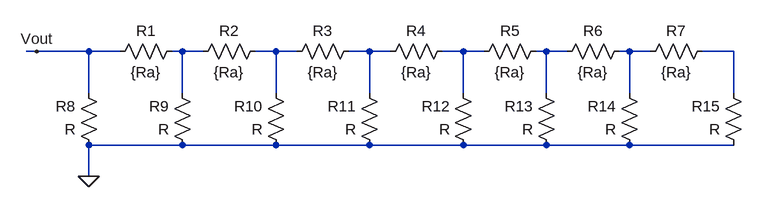
[diagram p0: schematic Draft1.asc]
Draft1.asc, the LTspice schematic file:
Version 4.1
SHEET 1 1108 680
WIRE 16 -80 0 -80
WIRE 96 -80 16 -80
WIRE 144 -80 96 -80
WIRE 240 -80 224 -80
WIRE 272 -80 240 -80
WIRE 384 -80 352 -80
WIRE 416 -80 384 -80
WIRE 528 -80 496 -80
WIRE 560 -80 528 -80
WIRE 672 -80 640 -80
WIRE 704 -80 672 -80
WIRE 800 -80 784 -80
WIRE 832 -80 800 -80
WIRE 928 -80 912 -80
WIRE 960 -80 928 -80
WIRE 1088 -80 1040 -80
WIRE 96 -16 96 -80
WIRE 240 -16 240 -80
WIRE 384 -16 384 -80
WIRE 528 -16 528 -80
WIRE 672 -16 672 -80
WIRE 800 -16 800 -80
WIRE 928 -16 928 -80
WIRE 1088 -16 1088 -80
WIRE 240 64 96 64
WIRE 384 64 240 64
WIRE 528 64 384 64
WIRE 672 64 528 64
WIRE 800 64 672 64
WIRE 928 64 800 64
WIRE 1088 64 928 64
WIRE 96 112 96 64
FLAG 96 112 0
FLAG 16 -80 Vout
SYMBOL res 240 -96 R90
WINDOW 0 0 56 VBottom 2
WINDOW 3 32 56 VTop 2
SYMATTR InstName R1
SYMATTR Value {Ra}
SYMBOL res 368 -96 R90
WINDOW 0 0 56 VBottom 2
WINDOW 3 32 56 VTop 2
SYMATTR InstName R2
SYMATTR Value {Ra}
SYMBOL res 512 -96 R90
WINDOW 0 0 56 VBottom 2
WINDOW 3 32 56 VTop 2
SYMATTR InstName R3
SYMATTR Value {Ra}
SYMBOL res 656 -96 R90
WINDOW 0 0 56 VBottom 2
WINDOW 3 32 56 VTop 2
SYMATTR InstName R4
SYMATTR Value {Ra}
SYMBOL res 800 -96 R90
WINDOW 0 0 56 VBottom 2
WINDOW 3 32 56 VTop 2
SYMATTR InstName R5
SYMATTR Value {Ra}
SYMBOL res 928 -96 R90
WINDOW 0 0 56 VBottom 2
WINDOW 3 32 56 VTop 2
SYMATTR InstName R6
SYMATTR Value {Ra}
SYMBOL res 1056 -96 R90
WINDOW 0 0 56 VBottom 2
WINDOW 3 32 56 VTop 2
SYMATTR InstName R7
SYMATTR Value {Ra}
SYMBOL res 112 80 R180
WINDOW 0 36 76 Left 2
WINDOW 3 36 40 Left 2
SYMATTR InstName R8
SYMBOL res 256 80 R180
WINDOW 0 36 76 Left 2
WINDOW 3 36 40 Left 2
SYMATTR InstName R9
SYMBOL res 400 80 R180
WINDOW 0 36 76 Left 2
WINDOW 3 36 40 Left 2
SYMATTR InstName R10
SYMBOL res 544 80 R180
WINDOW 0 36 76 Left 2
WINDOW 3 36 40 Left 2
SYMATTR InstName R11
SYMBOL res 688 80 R180
WINDOW 0 36 76 Left 2
WINDOW 3 36 40 Left 2
SYMATTR InstName R12
SYMBOL res 816 80 R180
WINDOW 0 36 76 Left 2
WINDOW 3 36 40 Left 2
SYMATTR InstName R13
SYMBOL res 944 80 R180
WINDOW 0 36 76 Left 2
WINDOW 3 36 40 Left 2
SYMATTR InstName R14
SYMBOL res 1104 80 R180
WINDOW 0 36 76 Left 2
WINDOW 3 36 40 Left 2
SYMATTR InstName R15

The netlist it stands for:
* Draft1.asc
R1 N001 Vout {Ra}
R2 N002 N001 {Ra}
R3 N003 N002 {Ra}
R4 N004 N003 {Ra}
R5 N005 N004 {Ra}
R6 N006 N005 {Ra}
R7 N007 N006 {Ra}
R8 0 Vout R
R9 0 N001 R
R10 0 N002 R
R11 0 N003 R
R12 0 N004 R
R13 0 N005 R
R14 0 N006 R
R15 0 N007 R
.backanno
.end